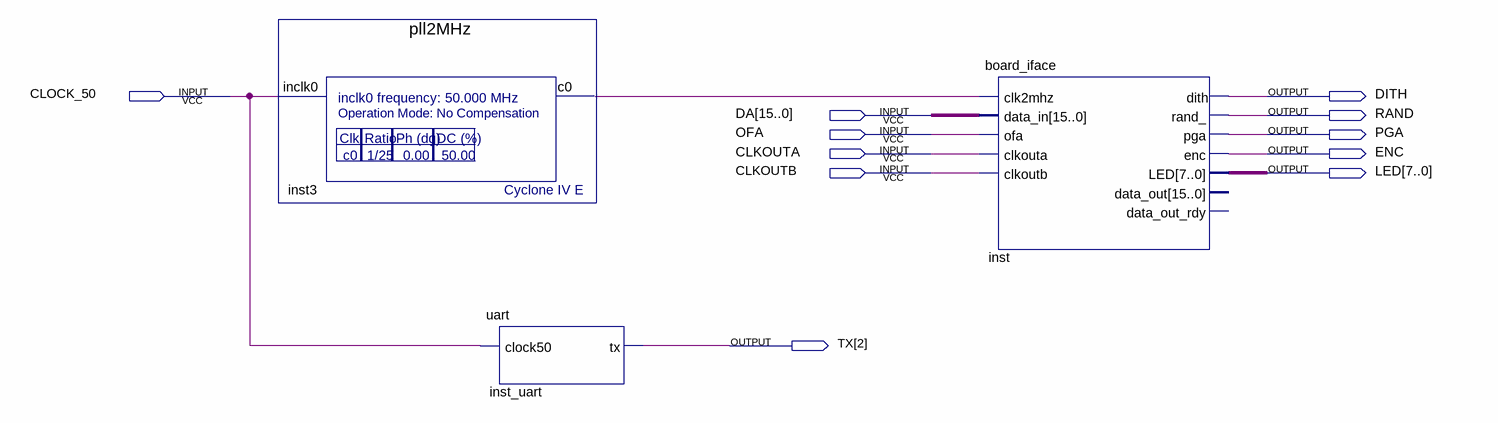
[diagram p0: schematic sheet]
// Quartus schematic receiver.bdf as structural Verilog: 3 symbols, 11 pins
module receiver (
  input  CLOCK_50,
  input  [15:0] DA,
  input  OFA,
  input  CLKOUTA,
  input  CLKOUTB,
  output DITH,
  output RAND,
  output PGA,
  output ENC,
  output [7:0] LED,
  output [2:2] TX
);

  wire inst3_c0;

  pll2MHz inst3 (.inclk0(CLOCK_50), .c0(inst3_c0));
  uart inst_uart (.clock50(CLOCK_50), .tx(TX[2]));
  board_iface inst (
    .clk2mhz(inst3_c0), .data_in(DA), .ofa(OFA), .clkouta(CLKOUTA), .clkoutb(CLKOUTB), .dith(DITH),
    .rand_(RAND), .pga(PGA), .enc(ENC), .LED(LED));  // open: data_out, data_out_rdy
endmodule
